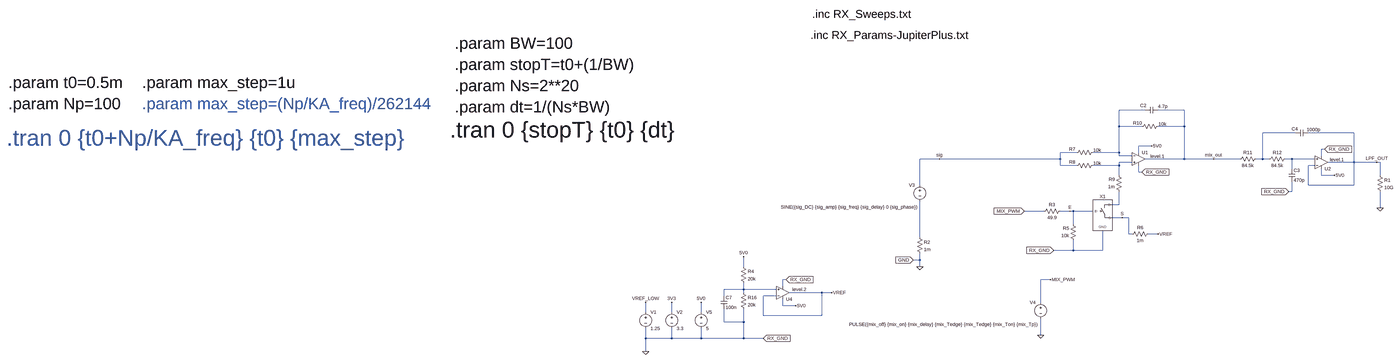
[diagram p0: schematic PLC_RX_Channel_Mixer_FFT.asc, whole sheet]
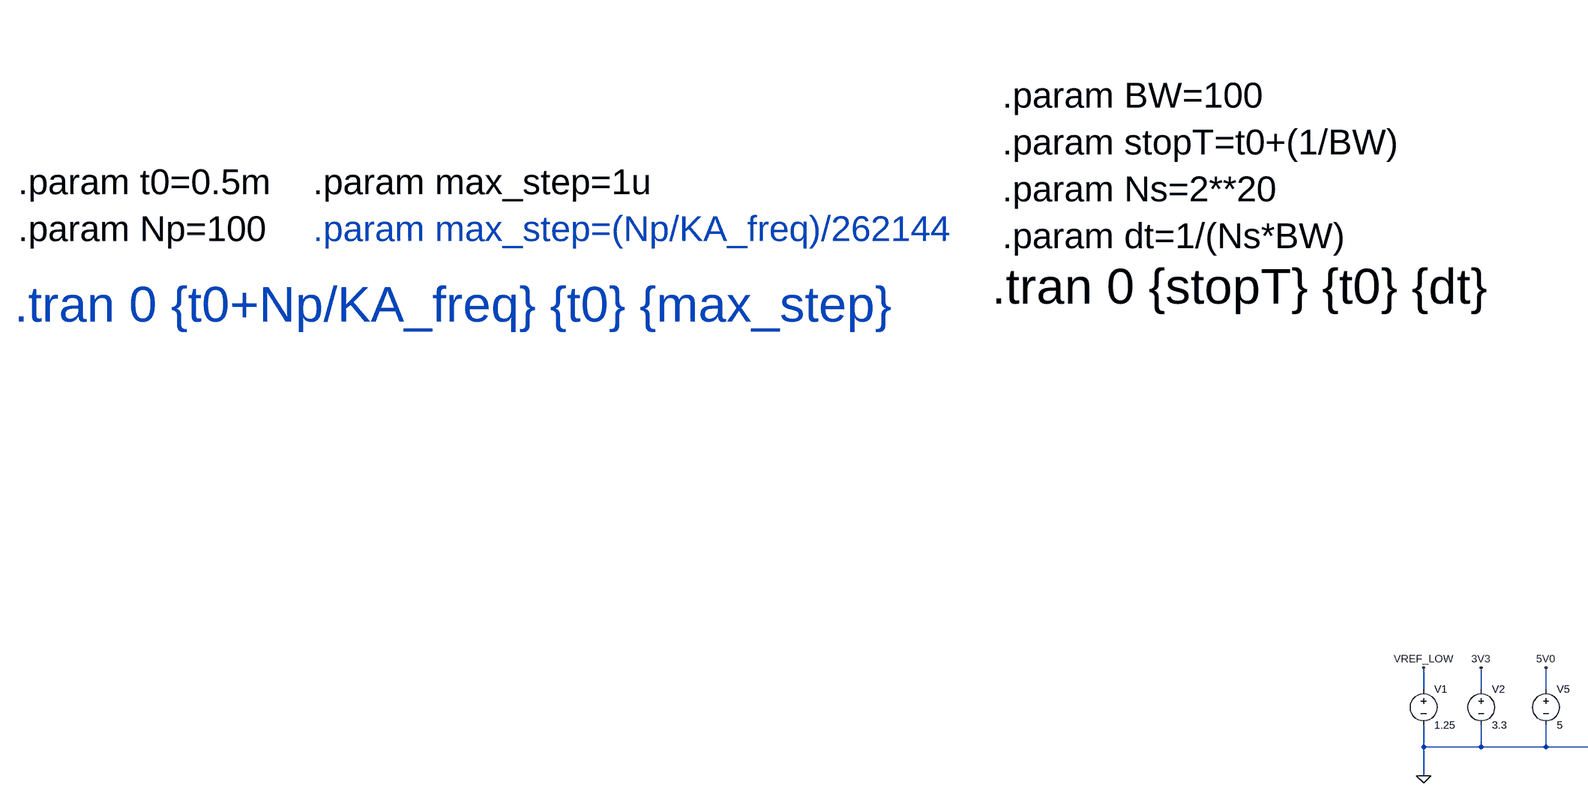
[diagram p1: schematic PLC_RX_Channel_Mixer_FFT.asc, part, row 1 of 1, column 1 of 2]
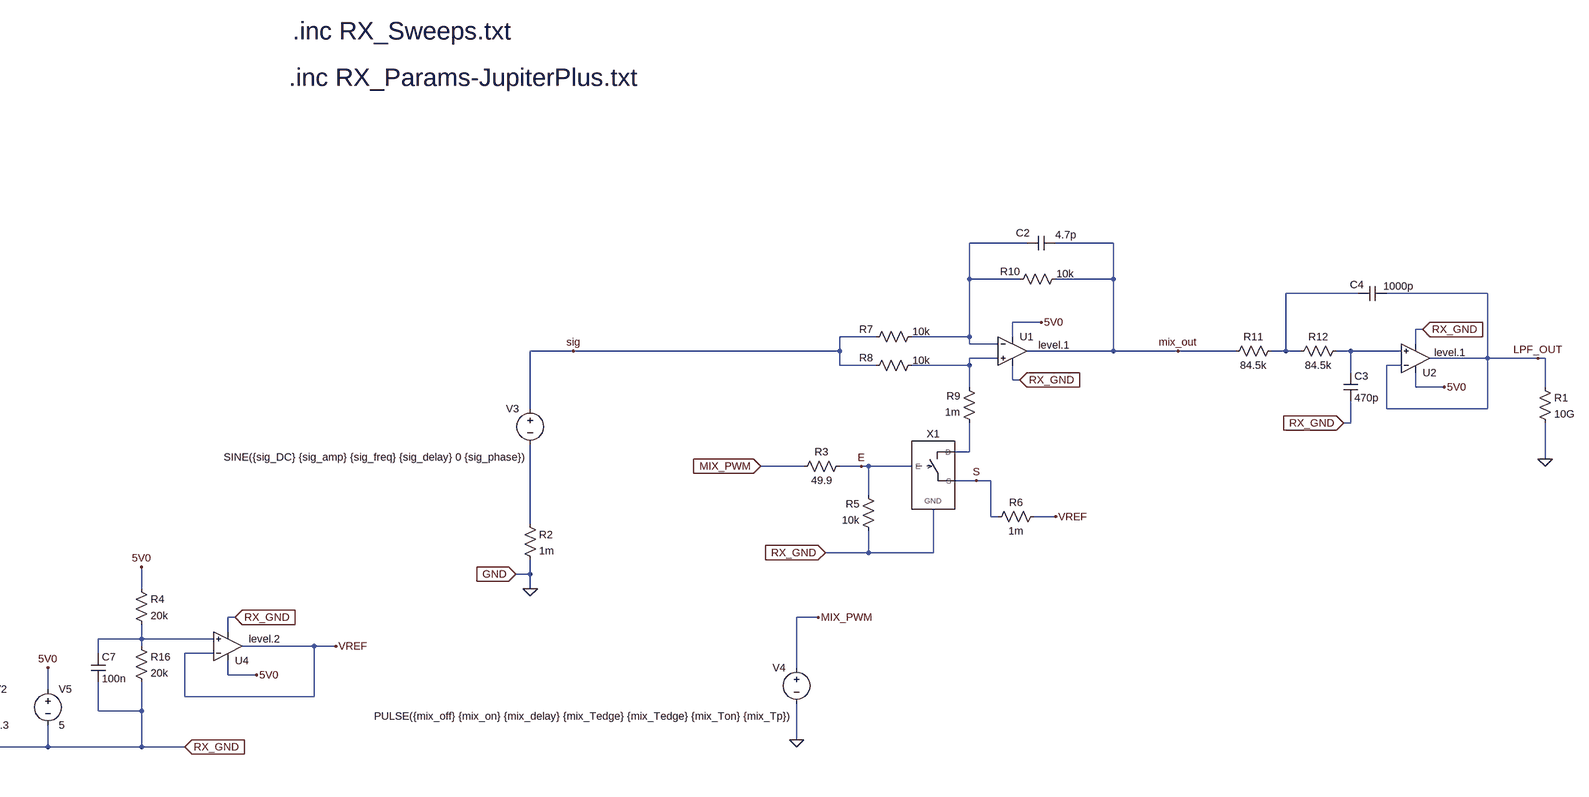
[diagram p2: schematic PLC_RX_Channel_Mixer_FFT.asc, part, row 1 of 1, column 2 of 2]
PLC_RX_Channel_Mixer_FFT.asc, the LTspice schematic file:
Version 4
SHEET 1 2104 5400
WIRE -3632 -288 -3760 -288
WIRE -3440 -288 -3568 -288
WIRE -3760 -208 -3760 -288
WIRE -3648 -208 -3760 -208
WIRE -3440 -208 -3440 -288
WIRE -3440 -208 -3568 -208
WIRE -2896 -176 -3056 -176
WIRE -2608 -176 -2832 -176
WIRE -3600 -112 -3664 -112
WIRE -2752 -96 -2768 -96
WIRE -3968 -80 -4048 -80
WIRE -3760 -80 -3760 -208
WIRE -3760 -80 -3888 -80
WIRE -3664 -80 -3664 -112
WIRE -3760 -64 -3760 -80
WIRE -3696 -64 -3760 -64
WIRE -2768 -64 -2768 -96
WIRE -4640 -48 -4736 -48
WIRE -4048 -48 -4048 -80
WIRE -4048 -48 -4640 -48
WIRE -3440 -48 -3440 -208
WIRE -3440 -48 -3632 -48
WIRE -3296 -48 -3440 -48
WIRE -3168 -48 -3296 -48
WIRE -3056 -48 -3056 -176
WIRE -3056 -48 -3088 -48
WIRE -3024 -48 -3056 -48
WIRE -2912 -48 -2944 -48
WIRE -2800 -48 -2912 -48
WIRE -3696 -32 -3760 -32
WIRE -2608 -32 -2608 -176
WIRE -2608 -32 -2736 -32
WIRE -2496 -32 -2608 -32
WIRE -2480 -32 -2496 -32
WIRE -4048 -16 -4048 -48
WIRE -3968 -16 -4048 -16
WIRE -3760 -16 -3760 -32
WIRE -3760 -16 -3888 -16
WIRE -2800 -16 -2832 -16
WIRE -2912 0 -2912 -48
WIRE -3664 16 -3664 -16
WIRE -3648 16 -3664 16
WIRE -3760 32 -3760 -16
WIRE -2768 32 -2768 0
WIRE -2704 32 -2768 32
WIRE -2480 32 -2480 -32
WIRE -4736 80 -4736 -48
WIRE -2832 80 -2832 -16
WIRE -2608 80 -2608 -32
WIRE -2608 80 -2832 80
WIRE -2912 112 -2912 64
WIRE -2912 112 -2928 112
WIRE -3760 176 -3760 112
WIRE -3760 176 -3792 176
WIRE -2480 192 -2480 112
WIRE -4128 208 -4224 208
WIRE -4000 208 -4048 208
WIRE -3984 208 -4000 208
WIRE -3888 208 -3984 208
WIRE -3744 240 -3792 240
WIRE -3712 240 -3744 240
WIRE -3984 272 -3984 208
WIRE -3712 320 -3712 240
WIRE -3696 320 -3712 320
WIRE -3568 320 -3616 320
WIRE -4736 336 -4736 160
WIRE -3984 400 -3984 352
WIRE -3984 400 -4080 400
WIRE -3840 400 -3840 304
WIRE -3840 400 -3984 400
WIRE -4736 448 -4736 416
WIRE -4736 448 -4768 448
WIRE -5600 480 -5600 432
WIRE -4736 480 -4736 448
WIRE -5392 544 -5408 544
WIRE -4096 544 -4144 544
WIRE -5408 576 -5408 544
WIRE -5600 592 -5600 560
WIRE -5600 592 -5696 592
WIRE -5440 592 -5600 592
WIRE -5600 608 -5600 592
WIRE -5216 608 -5376 608
WIRE -5168 608 -5216 608
WIRE -5696 624 -5696 592
WIRE -5440 624 -5504 624
WIRE -4144 656 -4144 544
WIRE -5408 672 -5408 640
WIRE -5344 672 -5408 672
WIRE -6080 704 -6080 656
WIRE -5952 704 -5952 656
WIRE -5808 704 -5808 656
WIRE -5504 720 -5504 624
WIRE -5216 720 -5216 608
WIRE -5216 720 -5504 720
WIRE -5696 752 -5696 688
WIRE -5600 752 -5600 688
WIRE -5600 752 -5696 752
WIRE -4144 816 -4144 736
WIRE -6080 832 -6080 784
WIRE -5952 832 -5952 784
WIRE -5952 832 -6080 832
WIRE -5808 832 -5808 784
WIRE -5808 832 -5952 832
WIRE -5600 832 -5600 752
WIRE -5600 832 -5808 832
WIRE -5504 832 -5600 832
WIRE -6080 896 -6080 832
FLAG -4736 480 0
FLAG -4640 -48 sig
FLAG -4768 448 GND
IOPIN -4768 448 In
FLAG -4144 816 0
FLAG -4096 544 MIX_PWM
FLAG -4224 208 MIX_PWM
IOPIN -4224 208 In
FLAG -4000 208 E
FLAG -3744 240 S
FLAG -3568 320 VREF
FLAG -4080 400 RX_GND
IOPIN -4080 400 In
FLAG -3648 16 RX_GND
IOPIN -3648 16 In
FLAG -2752 -96 RX_GND
IOPIN -2752 -96 In
FLAG -2928 112 RX_GND
IOPIN -2928 112 In
FLAG -3600 -112 5V0
FLAG -2704 32 5V0
FLAG -2480 192 0
FLAG -6080 656 VREF_LOW
FLAG -5952 656 3V3
FLAG -5504 832 RX_GND
IOPIN -5504 832 In
FLAG -5808 656 5V0
FLAG -5168 608 VREF
FLAG -5392 544 RX_GND
IOPIN -5392 544 In
FLAG -5344 672 5V0
FLAG -5600 432 5V0
FLAG -6080 896 0
FLAG -3296 -48 mix_out
FLAG -2496 -32 LPF_OUT
SYMBOL voltage -4736 64 M0
WINDOW 123 0 0 Left 2
WINDOW 39 0 0 Left 2
WINDOW 3 11 124 Left 2
SYMATTR Value SINE({sig_DC} {sig_amp} {sig_freq} {sig_delay} 0 {sig_phase})
SYMATTR InstName V3
SYMBOL res -4752 320 R0
SYMATTR InstName R2
SYMATTR Value 1m
SYMBOL voltage -4144 640 M0
WINDOW 123 0 0 Left 2
WINDOW 39 0 0 Left 2
WINDOW 3 11 124 Left 2
SYMATTR Value PULSE({mix_off} {mix_on} {mix_delay} {mix_Tedge} {mix_Tedge} {mix_Ton} {mix_Tp})
SYMATTR InstName V4
SYMBOL res -4032 192 R90
WINDOW 0 0 56 VBottom 2
WINDOW 3 32 56 VTop 2
SYMATTR InstName R3
SYMATTR Value 49.9
SYMBOL res -3968 368 R180
WINDOW 0 36 76 Left 2
WINDOW 3 36 40 Left 2
SYMATTR InstName R5
SYMATTR Value 10k
SYMBOL Analog_Switch -3840 208 R0
SYMATTR InstName X1
SYMBOL res -3600 304 R90
WINDOW 0 0 56 VBottom 2
WINDOW 3 32 56 VTop 2
SYMATTR InstName R6
SYMATTR Value 1m
SYMBOL res -3872 -96 R90
WINDOW 0 15 117 VBottom 2
WINDOW 3 -11 -5 VTop 2
SYMATTR InstName R7
SYMATTR Value 10k
SYMBOL res -3872 -32 R90
WINDOW 0 15 117 VBottom 2
WINDOW 3 -11 -5 VTop 2
SYMATTR InstName R8
SYMATTR Value 10k
SYMBOL res -3744 128 R180
WINDOW 0 36 76 Left 2
WINDOW 3 36 40 Left 2
SYMATTR InstName R9
SYMATTR Value 1m
SYMBOL Opamps\\UniversalOpamp2 -3664 -48 R0
WINDOW 38 58 -13 Left 2
SYMATTR SpiceModel level.1
SYMATTR InstName U1
SYMBOL res -3552 -224 R90
WINDOW 0 15 117 VBottom 2
WINDOW 3 -11 -5 VTop 2
SYMATTR InstName R10
SYMATTR Value 10k
SYMBOL cap -3568 -304 R90
WINDOW 0 9 73 VBottom 2
WINDOW 3 -18 -23 VTop 2
SYMATTR InstName C2
SYMATTR Value 4.7p
SYMBOL res -3072 -64 R90
WINDOW 0 0 56 VBottom 2
WINDOW 3 32 56 VTop 2
SYMATTR InstName R11
SYMATTR Value 84.5k
SYMBOL res -2928 -64 R90
WINDOW 0 0 56 VBottom 2
WINDOW 3 32 56 VTop 2
SYMATTR InstName R12
SYMATTR Value 84.5k
SYMBOL Opamps\\UniversalOpamp2 -2768 -32 M180
WINDOW 38 42 13 Left 2
SYMATTR SpiceModel level.1
SYMATTR InstName U2
SYMBOL cap -2928 0 R0
SYMATTR InstName C3
SYMATTR Value 470p
SYMBOL cap -2832 -192 R90
WINDOW 0 12 66 VBottom 2
WINDOW 3 -16 -26 VTop 2
SYMATTR InstName C4
SYMATTR Value 1000p
SYMBOL res -2496 16 R0
SYMATTR InstName R1
SYMATTR Value 10G
SYMBOL voltage -6080 688 R0
WINDOW 123 0 0 Left 2
WINDOW 39 0 0 Left 2
SYMATTR InstName V1
SYMATTR Value 1.25
SYMBOL voltage -5952 688 R0
WINDOW 123 0 0 Left 2
WINDOW 39 0 0 Left 2
SYMATTR InstName V2
SYMATTR Value 3.3
SYMBOL voltage -5808 688 R0
WINDOW 123 0 0 Left 2
WINDOW 39 0 0 Left 2
SYMATTR InstName V5
SYMATTR Value 5
SYMBOL Opamps\\UniversalOpamp2 -5408 608 M180
WINDOW 38 47 16 Left 2
SYMATTR InstName U4
SYMBOL res -5616 464 R0
SYMATTR InstName R4
SYMATTR Value 20k
SYMBOL res -5616 592 R0
SYMATTR InstName R16
SYMATTR Value 20k
SYMBOL cap -5712 624 R0
SYMATTR InstName C7
SYMATTR Value 100n
TEXT -5272 -656 Left 5 !.inc RX_Params-JupiterPlus.txt
TEXT -5264 -760 Left 5 !.inc RX_Sweeps.txt
TEXT -7016 -616 Left 6 !.param BW=100\n.param stopT=t0+(1/BW)\n.param Ns=2**20\n.param dt=1/(Ns*BW)
TEXT -7040 -192 Left 7 !.tran 0 {stopT} {t0} {dt}
TEXT -9640 -424 Left 6 !.param t0=0.5m\n.param Np=100
TEXT -9648 -152 Left 7 ;.tran 0 {t0+Np/KA_freq} {t0} {max_step}
TEXT -8984 -424 Left 6 !.param max_step=1u
TEXT -8984 -320 Left 6 ;.param max_step=(Np/KA_freq)/262144

The netlist it stands for:
* PLC_RX_Channel_Mixer_FFT.asc
V3 sig N006 SINE({sig_DC} {sig_amp} {sig_freq} {sig_delay} 0 {sig_phase})
R2 N006 0 1m
V4 MIX_PWM 0 PULSE({mix_off} {mix_on} {mix_delay} {mix_Tedge} {mix_Tedge} {mix_Ton} {mix_Tp})
R3 E MIX_PWM 49.9
R5 0 E 10k
XX1 E 0 S N005 Analog_Switch  ; pins E GND S D
R6 VREF S 1m
R7 N001 sig 10k
R8 N004 sig 10k
R9 N005 N004 1m
XU1 N004 N001 5V0 0 mix_out level.1 Avol=1Meg GBW=10Meg Slew=10Meg ilimit=25m rail=0 Vos=0 phimargin=45 en=0 enk=0 in=0 ink=0 Rin=500Meg  ; pins IN+ IN- V+ V- OUT
R10 mix_out N001 10k
C2 mix_out N001 4.7p
R11 N002 mix_out 84.5k
R12 N003 N002 84.5k
XU2 N003 LPF_OUT 5V0 0 LPF_OUT level.1 Avol=1Meg GBW=10Meg Slew=10Meg ilimit=25m rail=0 Vos=0 phimargin=45 en=0 enk=0 in=0 ink=0 Rin=500Meg  ; pins IN+ IN- V+ V- OUT
C3 N003 0 470p
C4 LPF_OUT N002 1000p
R1 LPF_OUT 0 10G
V1 VREF_LOW 0 1.25
V2 3V3 0 3.3
V5 5V0 0 5
XU4 N007 VREF 5V0 0 VREF level.2 Avol=1Meg GBW=10Meg Slew=10Meg ilimit=25m rail=0 Vos=0 phimargin=45 en=0 enk=0 in=0 ink=0 Rin=500Meg  ; pins IN+ IN- V+ V- OUT
R4 5V0 N007 20k
R16 N007 0 20k
C7 N007 0 100n
.inc RX_Params-JupiterPlus.txt
.inc RX_Sweeps.txt
.param BW=100
.param stopT=t0+(1/BW)
.param Ns=2**20
.param dt=1/(Ns*BW)
.tran 0 {stopT} {t0} {dt}
.param t0=0.5m
.param Np=100
* .tran 0 {t0+Np/KA_freq} {t0} {max_step}
.param max_step=1u
* .param max_step=(Np/KA_freq)/262144
.lib UniversalOpamps2.sub
.backanno
.end